# Altium schematic sheet Lcd&Touch.SchDoc
size A4
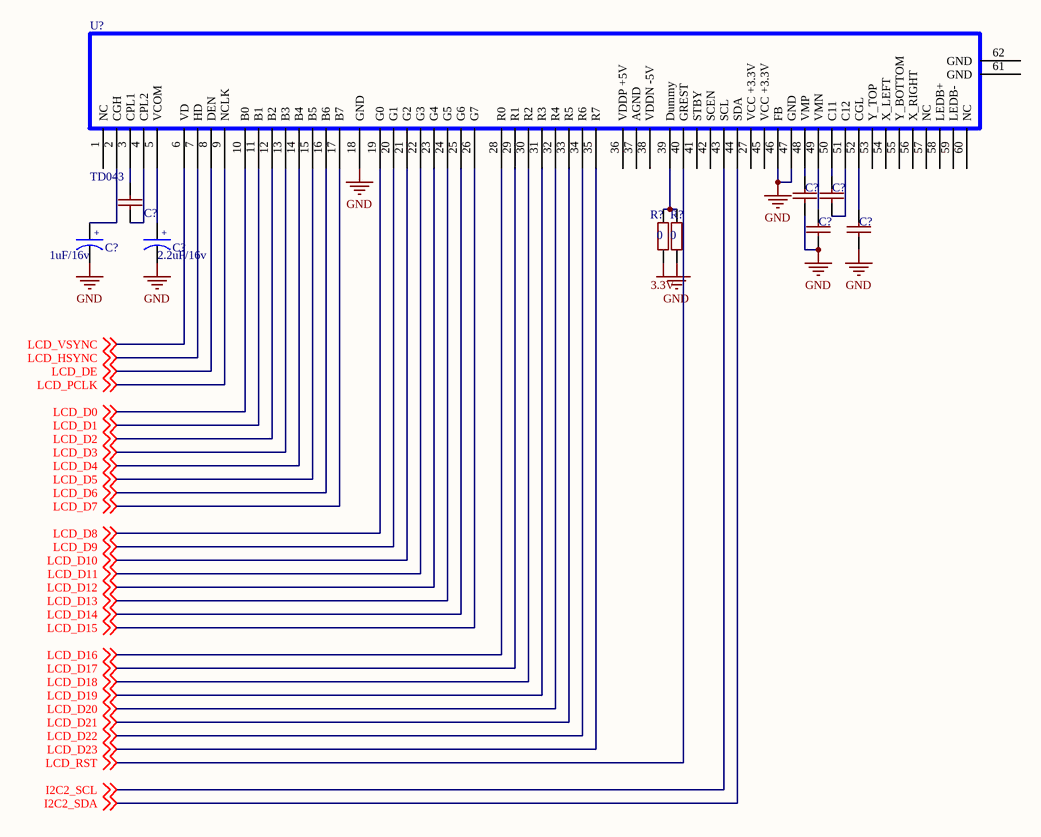
[diagram p0: Lcd&Touch.SchDoc]

## Parts
(Parts that share a designator on the sheet are numbered #1, #2 ... from top to bottom, then left to right.)
C?#1  Cap  [电容5]  (value not drawn)
C?#2  Cap  [电容5]  (value not drawn)
C?#3  Cap  [电容5]  (value not drawn)
C?#4  Cap  [电容5]  (value not drawn)
C?#5  Cap  [电容5]  (value not drawn)
C?#6  1uF/16v  [CASE A]
C?#7  2.2uF/16v  [CASE A]
R?#1  0  [0805_SMD_R]
R?#2  0  [0805_SMD_R]
U?  TD043  [FPC-0.5-60-H]

## Nets
3.3V: R?#1.1
GND: C?#1.2 C?#4.2 C?#5.2 C?#6.2 C?#7.2 R?#2.1 U?.18(GND) U?.46(FB) U?.47(GND)
I2C2_SCL: U?.43(SCL) ; off-sheet I2C2_SCL
I2C2_SDA: U?.44(SDA) ; off-sheet I2C2_SDA
LCD_D0: U?.10(B0) ; off-sheet LCD_D0
LCD_D1: U?.11(B1) ; off-sheet LCD_D1
LCD_D2: U?.12(B2) ; off-sheet LCD_D2
LCD_D3: U?.13(B3) ; off-sheet LCD_D3
LCD_D4: U?.14(B4) ; off-sheet LCD_D4
LCD_D5: U?.15(B5) ; off-sheet LCD_D5
LCD_D6: U?.16(B6) ; off-sheet LCD_D6
LCD_D7: U?.17(B7) ; off-sheet LCD_D7
LCD_D8: U?.19(G0) ; off-sheet LCD_D8
LCD_D9: U?.20(G1) ; off-sheet LCD_D9
LCD_D10: U?.21(G2) ; off-sheet LCD_D10
LCD_D11: U?.22(G3) ; off-sheet LCD_D11
LCD_D12: U?.23(G4) ; off-sheet LCD_D12
LCD_D13: U?.24(G5) ; off-sheet LCD_D13
LCD_D14: U?.25(G6) ; off-sheet LCD_D14
LCD_D15: U?.26(G7) ; off-sheet LCD_D15
LCD_D16: U?.28(R0) ; off-sheet LCD_D16
LCD_D17: U?.29(R1) ; off-sheet LCD_D17
LCD_D18: U?.30(R2) ; off-sheet LCD_D18
LCD_D19: U?.31(R3) ; off-sheet LCD_D19
LCD_D20: U?.32(R4) ; off-sheet LCD_D20
LCD_D21: U?.33(R5) ; off-sheet LCD_D21
LCD_D22: U?.34(R6) ; off-sheet LCD_D22
LCD_D23: U?.35(R7) ; off-sheet LCD_D23
LCD_DE: U?.8(DEN) ; off-sheet LCD_DE
LCD_HSYNC: U?.7(HD) ; off-sheet LCD_HSYNC
LCD_PCLK: U?.9(NCLK) ; off-sheet LCD_PCLK
LCD_RST: U?.40(GREST) ; off-sheet LCD_RST
LCD_VSYNC: U?.6(VD) ; off-sheet LCD_VSYNC
NetC?#1_1: C?#1.1 U?.48(VMP)
NetC?#2_1: C?#2.1 U?.50(C11)
NetC?#2_2: C?#2.2 U?.51(C12)
NetC?#3_1: C?#3.1 U?.3(CPL1)
NetC?#3_2: C?#3.2 U?.4(CPL2)
NetC?#4_1: C?#4.1 U?.49(VMN)
NetC?#5_1: C?#5.1 U?.52(CGL)
NetC?#6_1: C?#6.1 U?.2(CGH)
NetC?#7_1: C?#7.1 U?.5(VCOM)
NetR?#1_2: R?#1.2 R?#2.2 U?.39(Dummy)

Not connected (* = marked no-connect by the designer): U? 1(NC) 27(VCC_+3.3V) 36(VDDP_+5V) 37(AGND) 38(VDDN_-5V) 41(STBY) 42(SCEN) 45(VCC_+3.3V) 53(Y_TOP) 54(X_LEFT) 55(Y_BOTTOM) 56(X_RIGHT) 57(NC) 58(LEDB+) 59(LEDB-) 60(NC) 61(GND) 62(GND)

## Notes on the sheet
- (in symbol CAP  POL) +

## Library data of the parts
C?#6 C?#7 = CAP  POL: 电解电容; Value: R1HCX010MT50
R?#1 R?#2 = SMD_0805: 贴片电阻; 松下: RS05K101FT; 松下: RS05000FT; 松下: RS05K3321FT; 松下: RS05K6811FT; 松下: RS05K102FT; 松下: RS05K2211FT; 松下: RS05K103FT; 松下: RS05K5111FT; 松下: RS05K5110FT; 松下: RS05K5112FT; 松下: RS05K8251FT; 松下: RS05K2212FT; 松下: RS05K104FT; 松下: RS05K5113FT; 松下: RS05K105FT; 松下: RS05L106FT; 研究所: 贴装电阻_0805_0_F1%; 研究所: 贴装电阻_0805_100_F1%; 研究所: 贴装电阻_0805_51.1K_F1%; 研究所: 贴装电阻_0805_1K_F1%; 研究所: 贴装电阻_0805_2.21K_F1%; 研究所: 贴装电阻_0805_3.32K_F1%; 研究所: 贴装电阻_0805_5.11K_F1%; 研究所: 贴装电阻_0805_511K_F1%; 研究所: 贴装电阻_0805_6.81K_F1%; 研究所: 贴装电阻_0805_511_F1%; 研究所: 贴装电阻_0805_8.25K_F1%; 研究所: 贴装电阻_0805_10K_F1%; 研究所: 贴装电阻_0805_22.1K_F1%; 研究所: 贴装电阻_0805_100K_F1%; 研究所: 贴装电阻_0805_1M_F1%; 研究所: 贴装电阻_0805_10M_F1%